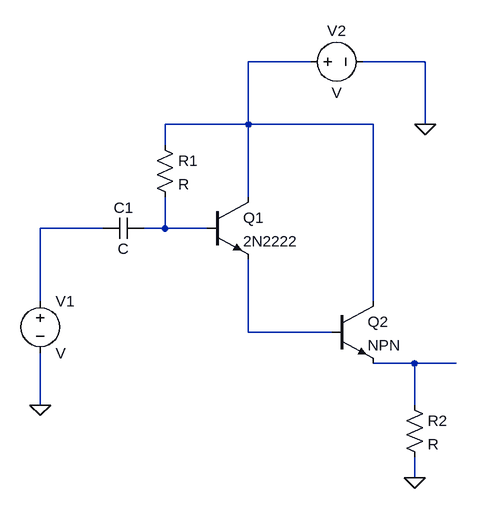
[diagram p0: schematic Draft2.asc]
Draft2.asc, the LTspice schematic file:
Version 4
SHEET 1 880 680
WIRE 352 -128 256 -128
WIRE 528 -128 432 -128
WIRE 256 -32 256 -128
WIRE 256 -32 128 -32
WIRE 448 -32 256 -32
WIRE 528 -32 528 -128
WIRE 128 0 128 -32
WIRE 256 80 256 -32
WIRE 32 128 -64 128
WIRE 128 128 128 80
WIRE 128 128 96 128
WIRE 192 128 128 128
WIRE -64 240 -64 128
WIRE 448 240 448 -32
WIRE 256 288 256 176
WIRE 384 288 256 288
WIRE 512 336 448 336
WIRE 576 336 512 336
WIRE -64 400 -64 320
WIRE 512 400 512 336
WIRE 512 512 512 480
FLAG 528 -32 0
FLAG 512 512 0
FLAG -64 400 0
SYMBOL npn 192 80 R0
SYMATTR InstName Q1
SYMATTR Value 2N2222
SYMBOL npn 384 240 R0
SYMATTR InstName Q2
SYMBOL res 496 384 R0
SYMATTR InstName R2
SYMBOL res 112 -16 R0
SYMATTR InstName R1
SYMBOL cap 96 112 R90
WINDOW 0 0 32 VBottom 2
WINDOW 3 32 32 VTop 2
SYMATTR InstName C1
SYMBOL voltage -64 224 R0
SYMATTR InstName V1
SYMBOL voltage 336 -128 R270
WINDOW 0 32 56 VTop 2
WINDOW 3 -32 56 VBottom 2
SYMATTR InstName V2

The netlist it stands for:
* Draft2.asc
Q1 N001 N003 N004 0 2N2222
Q2 N001 N004 N005 0 NPN
R2 N005 0 R
R1 N001 N003 R
C1 N003 N002 C
V1 N002 0 V
V2 N001 0 V
.model NPN NPN
.model PNP PNP
.lib standard.bjt
.backanno
.end